# EasyEDA schematic SCH_HUB-USB_2025-02-13.json
TITLE: HUB USB; REV: 1.0; Date: 2024-12-19; Sheet: 1/1; Drawn By: Ivan Muñoz; Company: IES Joan Ramis
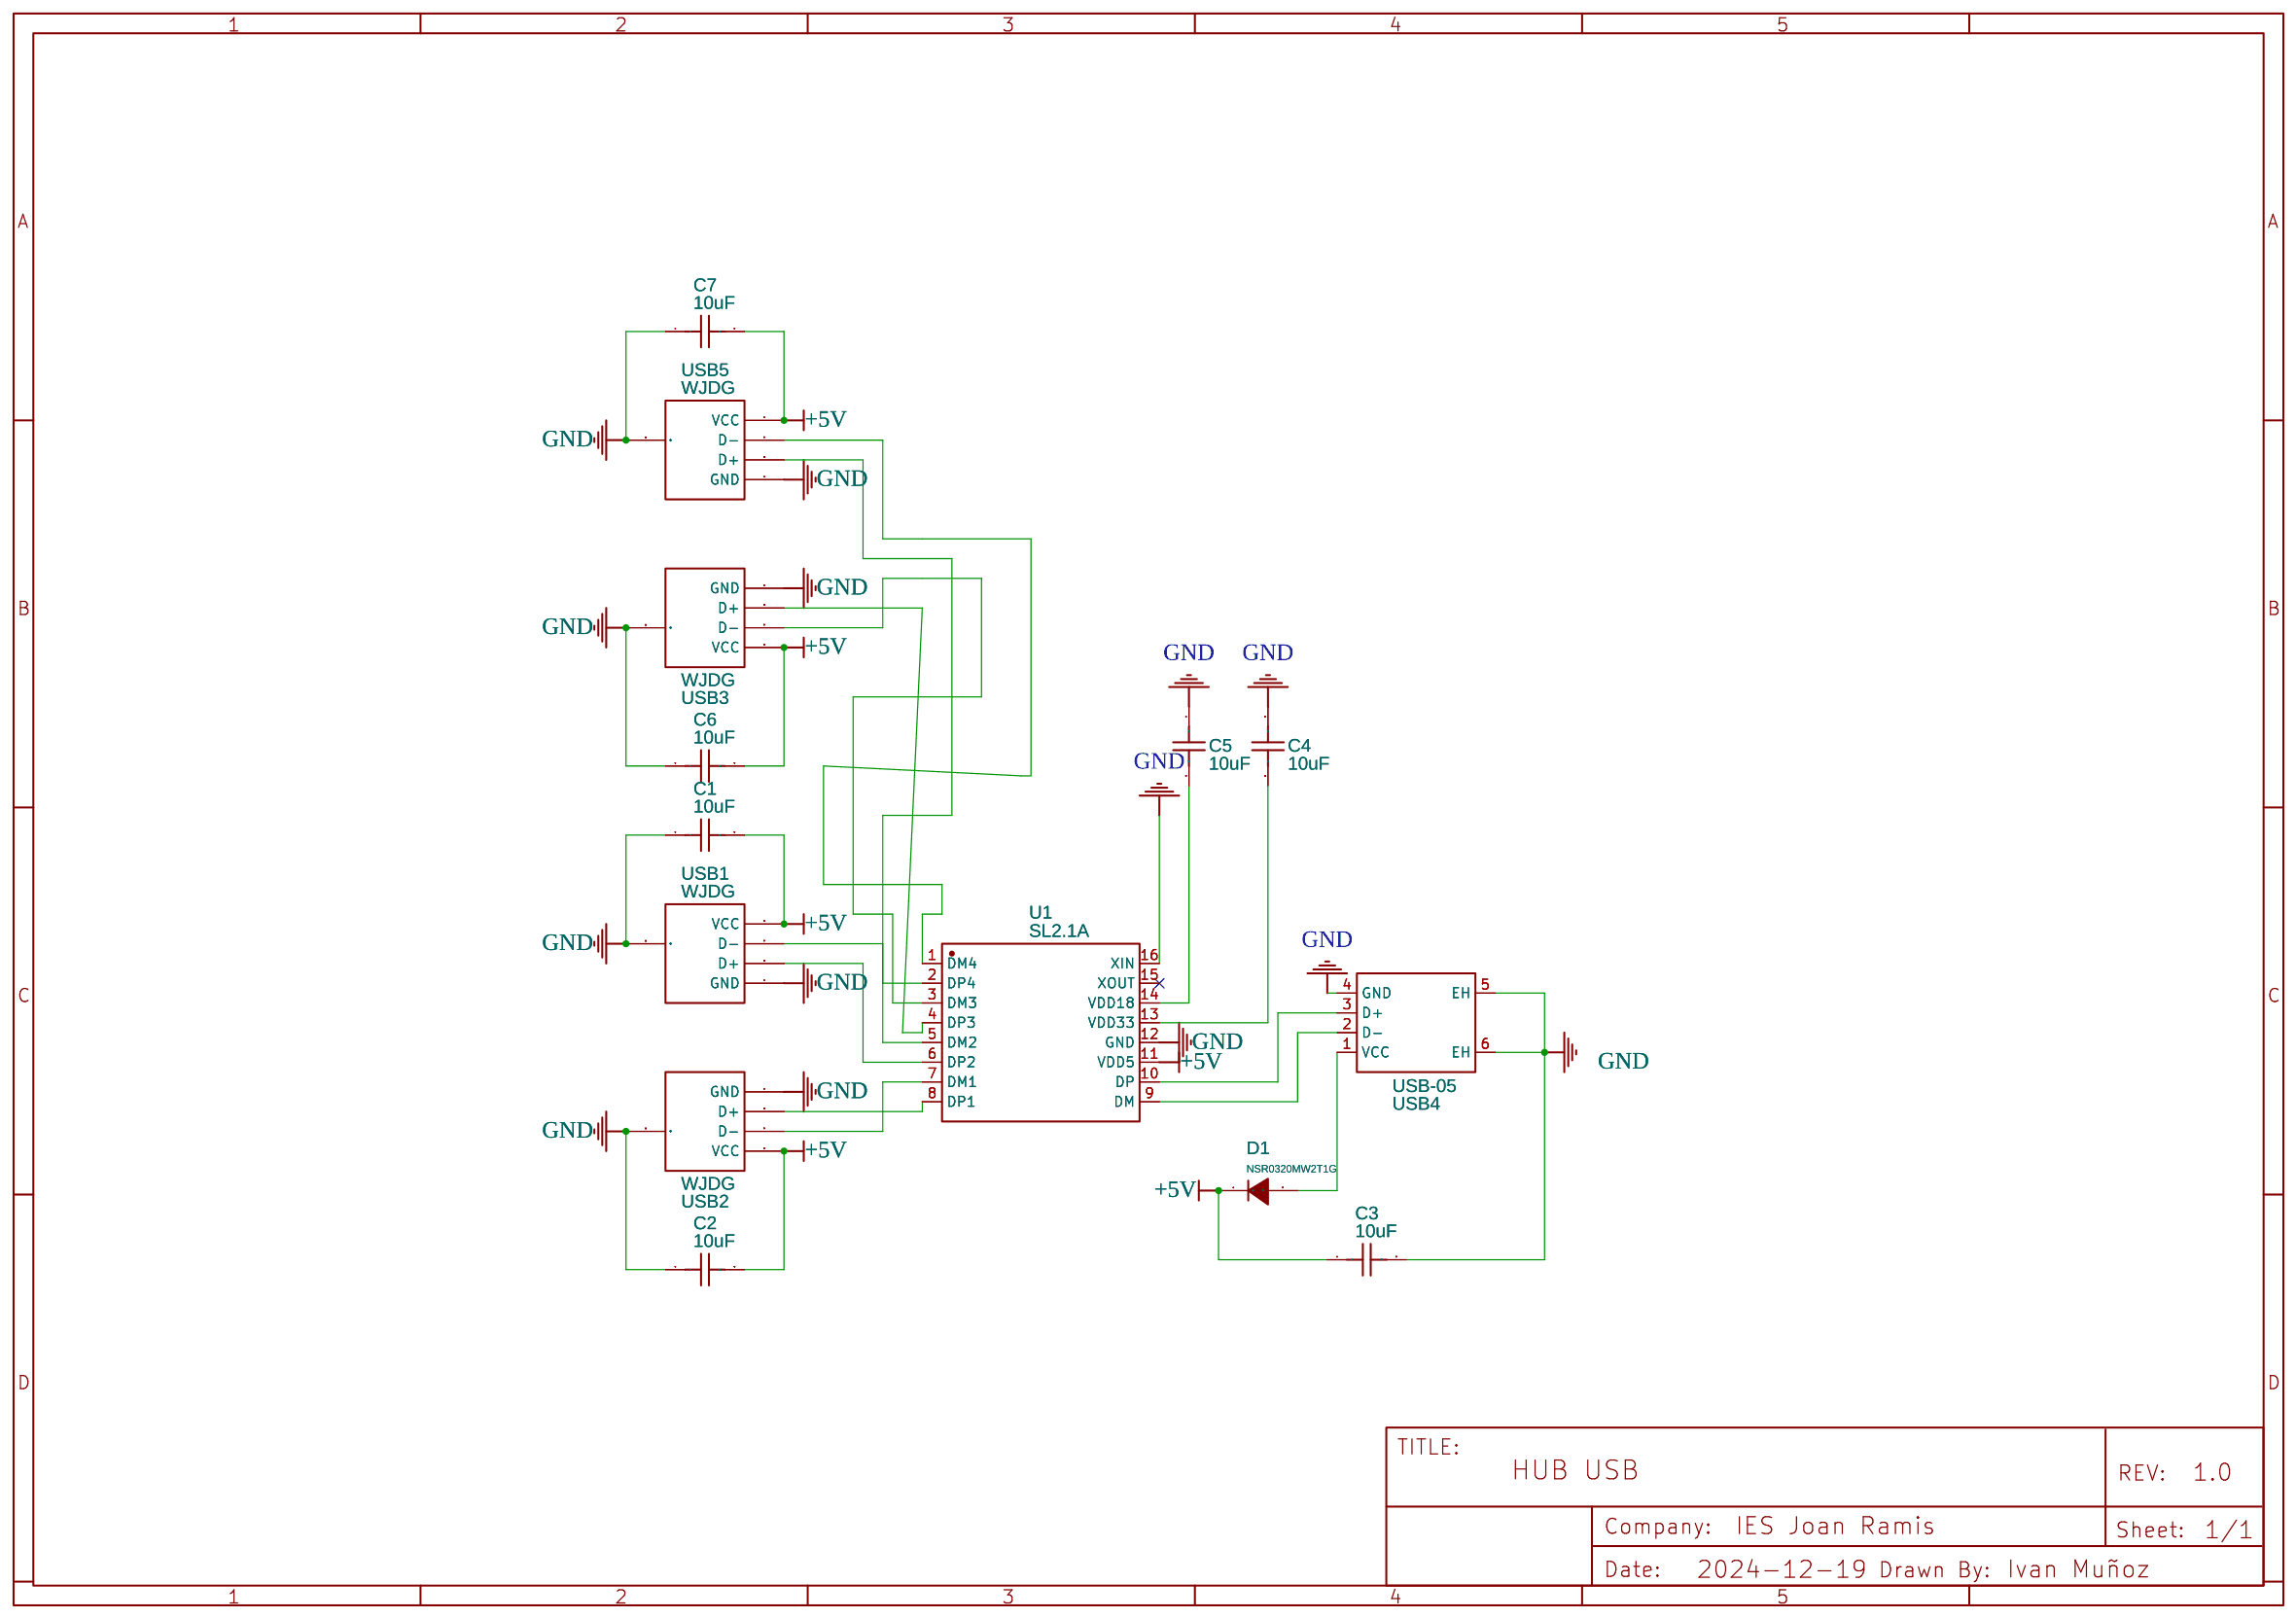
[diagram p0: schematic sheet]

## Parts
C1  10uF  [C0603]
C2  10uF  [C0603]
C3  10uF  [C0603]
C4  10uF  [C0603]
C5  10uF  [C0603]
C6  10uF  [C0603]
C7  10uF  [C0603]
D1  NSR0320MW2T1G  [SOD-323_L1.8-W1.3-LS2.5-RD]
U1  SL2.1A  [SOP-16_L10.0-W3.9-P1.27-LS6.0-BL]
USB1  WJDG  [USB-A-TH_AF-WJDG]
USB2  WJDG  [USB-A-TH_AF-WJDG]
USB3  WJDG  [USB-A-TH_AF-WJDG]
USB4  USB-05  [USB-A-TH_USB-05]
USB5  WJDG  [USB-A-TH_AF-WJDG]

## Library data of the parts
C1-C7 = CL10A106KP8NNNC: Supplier: LCSC; Manufacturer: SAMSUNG(三星); Supplier Part: C19702; JLCPCB Part Class: Basic Part
D1 = NSR0320MW2T1G: Supplier: LCSC; Manufacturer: onsemi(安森美); Supplier Part: C48192; JLCPCB Part Class: Extended Part
U1 = SL2.1A: Contributor: LCSC; Supplier: LCSC; Supplier Part: C192893; Manufacturer: CoreChips(和芯润德); JLCPCB Part Class: Extended Part
USB1-USB3 USB5 = AF 90° WJDG: Contributor: LCSC; Supplier: LCSC; Supplier Part: C456018; Manufacturer: SHOU HAN(首韩); JLCPCB Part Class: Extended Part
USB4 = USB-05: Contributor: LCSC; Supplier: LCSC; Manufacturer: SOFNG(硕方); Supplier Part: C112454; JLCPCB Part Class: Extended Part

## Nets
+5V: C1.2 C2.2 C3.1 C6.2 C7.2 D1.1(C) U1.11(VDD5) USB1.1(VCC) USB2.1(VCC) USB3.1(VCC) USB5.1(VCC)
GND: C1.1 C2.1 C3.2 C4.1 C5.1 C6.1 C7.1 U1.12(GND) U1.16(XIN) USB1.4(GND) USB1.5(SHLD) USB2.4(GND) USB2.5(SHLD) USB3.4(GND) USB3.5(SHLD) USB4.4(GND) USB4.5(EH) USB4.6(EH) USB5.4(GND) USB5.5(SHLD)
Net-(C4-2): C4.2 U1.13(VDD33)
Net-(C5-2): C5.2 U1.14(VDD18)
Net-(D1-2): D1.2(A) USB4.1(VCC)
Net-(U1-1): U1.1(DM4) USB5.2(D-)
Net-(U1-2): U1.2(DP4) USB5.3(D+)
Net-(U1-3): U1.3(DM3) USB3.2(D-)
Net-(U1-4): U1.4(DP3) USB3.3(D+)
Net-(U1-5): U1.5(DM2) USB1.2(D-)
Net-(U1-6): U1.6(DP2) USB1.3(D+)
Net-(U1-7): U1.7(DM1) USB2.2(D-)
Net-(U1-8): U1.8(DP1) USB2.3(D+)
Net-(U1-9): U1.9(DM) USB4.2(D-)
Net-(U1-10): U1.10(DP) USB4.3(D+)

Not connected (* = marked no-connect by the designer): U1 15(XOUT)*
